# EAGLE design mssaPIC12smd (EAGLE 9.6.2)
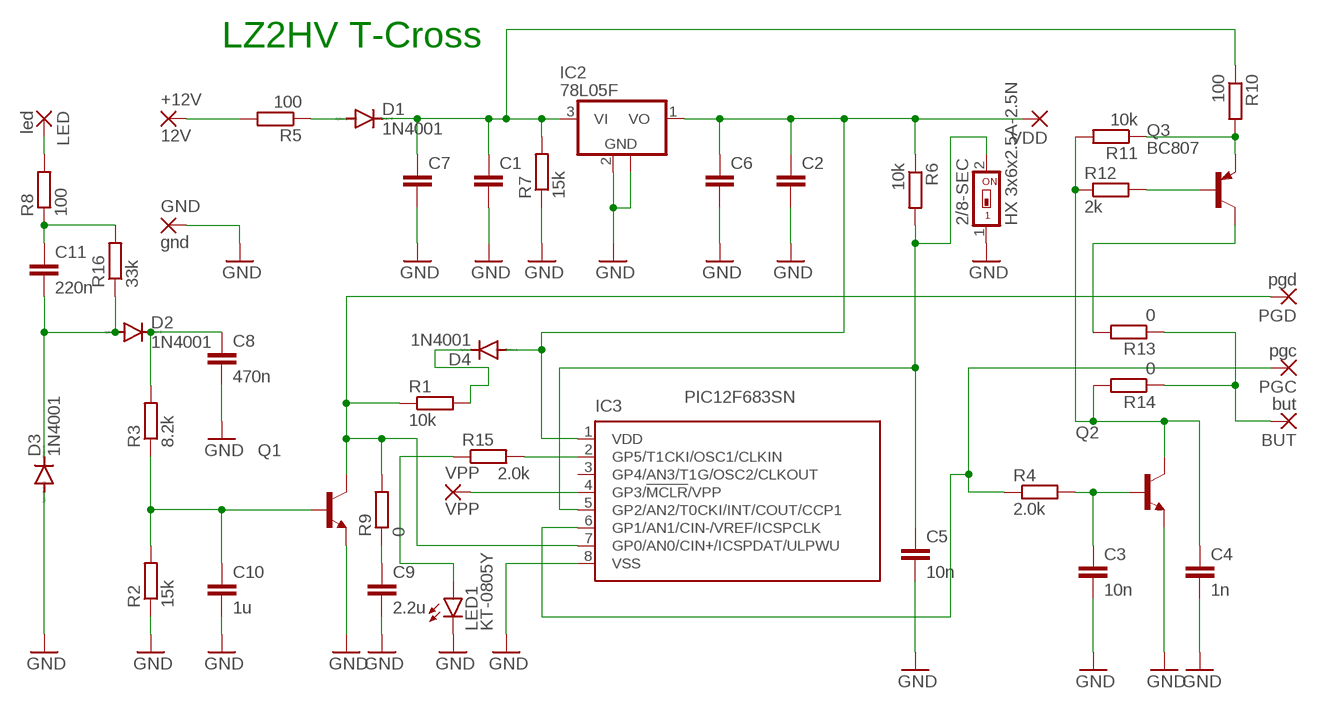
[diagram p0: schematic, sheet 1]

## Parts
2/8-SEC  HX 3x6x2.5A-2.5N  SWS001  [SMS-001]
+12V  12V  3,17/1,3  [3,17/1,3]
BUT  but  3,17/1,3  [3,17/1,3]
C1  100n  C-EUC1206K  [C1206K]
C2  220n  C-EUC1206K  [C1206K]
C3  10n  C-EUC1206K  [C1206K]
C4  1n  C-EUC1206K  [C1206K]
C5  10n  C-EUC1206K  [C1206K]
C6  100n  C-EUC1206K  [C1206K]
C7  100n  C-EUC1206K  [C1206K]
C8  470n  C-EUC1206K  [C1206K]
C9  2.2u  C-EUC1206K  [C1206K]
C10  1u  C-EUC1206K  [C1206K]
C11  220n  C-EUC1206K  [C1206K]
D1  1N4001  CGRM4001-G  [SOD-123_MINI-SMA]
D2  1N4001  CGRM4001-G  [SOD-123_MINI-SMA]
D3  1N4001  CGRM4001-G  [SOD-123_MINI-SMA]
D4  1N4001  CGRM4001-G  [SOD-123_MINI-SMA]
GND  gnd  3,17/1,3  [3,17/1,3]
IC2  78L05F  [SOT89]
IC3  PIC12F683SN  [SO-08]
LED  led  3,17/1,3  [3,17/1,3]
LED1  KT-0805Y  LEDCHIP-LED0805  [CHIP-LED0805]
PGC  pgc  2,15/1,0  [2,15/1,0]
PGD  pgd  2,15/1,0  [2,15/1,0]
Q1  BC817  BC817-40LT1SMD  [SOT23-BEC]
Q2  BC817  BC817-40LT1SMD  [SOT23-BEC]
Q3  BC807  BC807-40SMD  [SOT23-BEC]
R1  10k  R-EU_M1206  [M1206]
R2  15k  R-EU_M1206  [M1206]
R3  8.2k  R-EU_M1206  [M1206]
R4  2.0k  R-EU_M1206  [M1206]
R5  100  R-EU_M1206  [M1206]
R6  10k  R-EU_M1206  [M1206]
R7  15k  R-EU_M1206  [M1206]
R8  100  R-EU_M1206  [M1206]
R9  0  R-EU_R0603  [R0603]
R10  100  R-EU_M1206  [M1206]
R11  10k  R-EU_M1206  [M1206]
R12  2k  R-EU_M1206  [M1206]
R13  0  R-EU_R0603  [R0603]
R14  0  R-EU_R0603  [R0603]
R15  2.0k  R-EU_R0603  [R0603]
R16  33k  R-EU_M1206  [M1206]
VDD  VDD  2,15/1,0  [2,15/1,0]
VPP  VPP  2,15/1,0  [2,15/1,0]

## Nets
GND: 2/8-SEC.1 C1.2 C2.2 C3.2 C4.2 C5.2 C6.2 C7.2 C8.2 C9.2 C10.2 D3.A GND.1(P) IC2.2(GND) IC2.2@1(GND) IC3.8(VSS) LED1.C Q1.E Q2.E R2.1 R7.1
N$1: C1.1 C7.1 D1.C IC2.3(VI) R7.2 R10.1
N$2: C11.2 D2.A D3.C R16.1
N$3: C10.1 Q1.B R2.2 R3.1
N$4: IC3.7(GP0/AN0/CIN+/ICSPDAT/ULPWU) PGD.1(P) Q1.C R1.1 R9.2
N$5: +12V.1(P) R5.2
N$6: IC3.6(GP1/AN1/CIN-/VREF/ICSPCLK) PGC.1(P) R4.1
N$7: C3.1 Q2.B R4.2
N$8: C4.1 Q2.C R11.2 R12.1 R14.2
N$9: C8.1 D2.C R3.2
N$10: D1.A R5.1
N$11: IC3.4(GP3/!MCLR!/VPP) VPP.1(P)
N$12: 2/8-SEC.2 C5.1 IC3.5(GP2/AN2/T0CKI/INT/COUT/CCP1) R6.2
N$13: C11.1 R8.1 R16.2
N$14: LED.1(P) R8.2
N$15: C9.1 R9.1
N$16: Q3.E R10.2 R11.1
N$17: Q3.C R13.2
N$18: Q3.B R12.2
N$19: BUT.1(P) R13.1 R14.1
N$20: IC3.2(GP5/T1CKI/OSC1/CLKIN) R15.2
N$21: LED1.A R15.1
N$22: D4.C R1.2
VDD: C2.1 C6.1 D4.A IC2.1(VO) IC3.1(VDD) R6.1 VDD.1(P)
Unconnected: IC3.3(GP4/AN3/T1G/OSC2/CLKOUT)

## Notes on the sheet
- LZ2HV T-Cross

## Library data of the parts
2/8-SEC = smd-special:SWS001: SMD Dip Switch 1 pol.
+12V BUT GND LED = wirepad:3,17/1,3: THROUGH-HOLE PAD
C1-C11 = rcl:C-EU: CAPACITOR, European symbol; SPICEPREFIX: C
D1-D4 = diode:CGRM400*-G: Molded plasitc,JEDEC SOD-123/Mini SMA Source: Comchip CGRM4001-G.pdf
IC2 = linear:78L*: POSITOIV-VOLTAGE REGULATORS Output up to 100 mA Source: Datasheet <http://focus.ti.com/lit/ds/symlink/ua78l05.pdf>
IC3 = microchip:PIC12F683: 8-Pin Flash-Based, 8-Bit CMOS Microcontrollers with nanoWatt Technology Source: http://ww1.microchip.com/downloads/en/DeviceDoc/41211D_.pdf; MF: MICROCHIP; MPN: PIC12F683-I/SN; OC_FARNELL: 9759042; OC_NEWARK: 61K3434
LED1 = led:LED: LED OSRAM: - CHIPLED LG R971, LG N971, LY N971, LG Q971, LY Q971, LO R971, LY R971 LH N974, LH R974 LS Q976, LO Q976, LY Q976 LO Q996 - Hyper CHIPLED LW Q18S LB Q993, LB Q99A, LB R99A - SideLED LS A670, LO A670, LY A670, LG A670, LP A670 LB A673, LV A673, LT A673, LW A673 LH A674 LY A675 LS A676, LA A676, LO A676, LY A676, LW A676 LS A679, LY A679, LG A679 - Hyper Micro SIDELED® LS Y876, LA Y876, LO Y876, LY Y876 LT Y87S - SmartLED LW L88C, LW L88S LB L89C, LB L89S, LG L890 LS L89K, LO L89K, LY L89K LS L896, LA L896, LO L896, LY L896 - TOPLED LS T670, LO T670, LY T670, LG T670, LP T670 LSG T670, LSP T670, LSY T670, LOP T670, LYG T670 LG T671, LOG T671, LSG T671 LB T673, LV T673, LT T673, LW T673 LH T674 LS T676, LA T676, LO T676, LY T676, LB T676, LH T676, LSB T676, LW T676 LB T67C, LV T67C, LT T67C, LS T67K, LO T67K, LY T67K, LW E67C LS E67B, LA E67B, LO E67B, LY E67B, LB E67C, LV E67C, LT E67C LW T67C LS T679, LY T679, LG T679 LS T770, LO T770, LY T770, LG T770, LP T770 LB T773, LV T773, LT T773, LW T773 LH T774 LS E675, LA E675, LY E675, LS T675 LS T776, LA T776, LO T776, LY T776, LB T776 LHGB T686 LT T68C, LB T68C - Hyper Mini TOPLED® LB M676 - Mini TOPLED Santana® LG M470 LS M47K, LO M47K, LY M47K Source: http://www.osram.convergy.de LUXEON: - LUMILED® LXK2-PW12-R00, LXK2-PW12-S00, LXK2-PW14-U00, LXK2-PW14-V00 LXK2-PM12-R00, LXK2-PM12-S00, LXK2-PM14-U00 LXK2-PE12-Q00, LXK2-PE12-R00, LXK2-PE12-S00, LXK2-PE14-T00, LXK2-PE14-U00 LXK2-PB12-K00, LXK2-PB12-L00, LXK2-PB12-M00, LXK2-PB14-N00, LXK2-PB14-P00, LXK2-PB14-Q00 LXK2-PR12-L00, LXK2-PR12-M00, LXK2-PR14-Q00, LXK2-PR14-R00 LXK2-PD12-Q00, LXK2-PD12-R00, LXK2-PD12-S00 LXK2-PH12-R00, LXK2-PH12-S00 LXK2-PL12-P00, LXK2-PL12-Q00, LXK2-PL12-R00 Source: www.luxeon.com KINGBRIGHT: KA-3528ASYC Source: www.kingbright.com
PGC PGD VDD VPP = wirepad:2,15/1,0: THROUGH-HOLE PAD
Q1 Q2 = transistor-npn:BC817*: NPN Transistor
Q3 = transistor-pnp:BC807*: PNP Transistror
R1-R16 = rcl:R-EU_: RESISTOR, European symbol; SPICEPREFIX: R

## Board
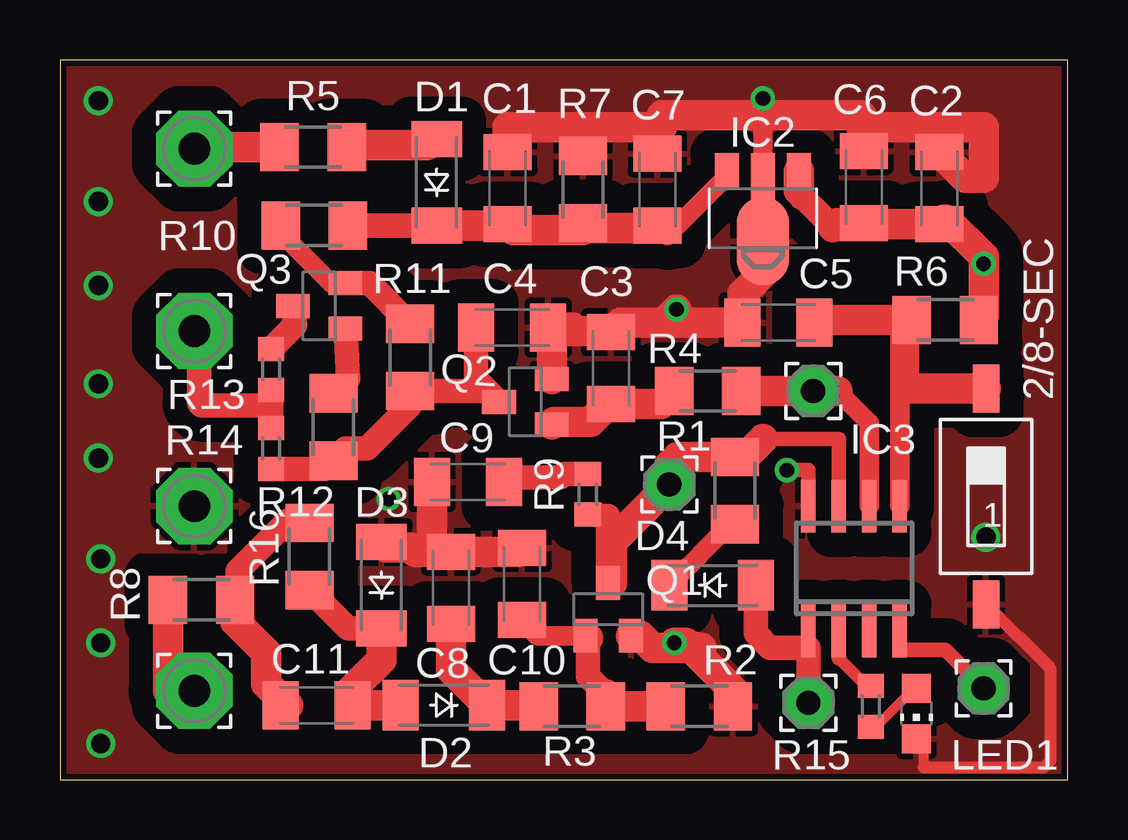
[diagram p1: board, top side]
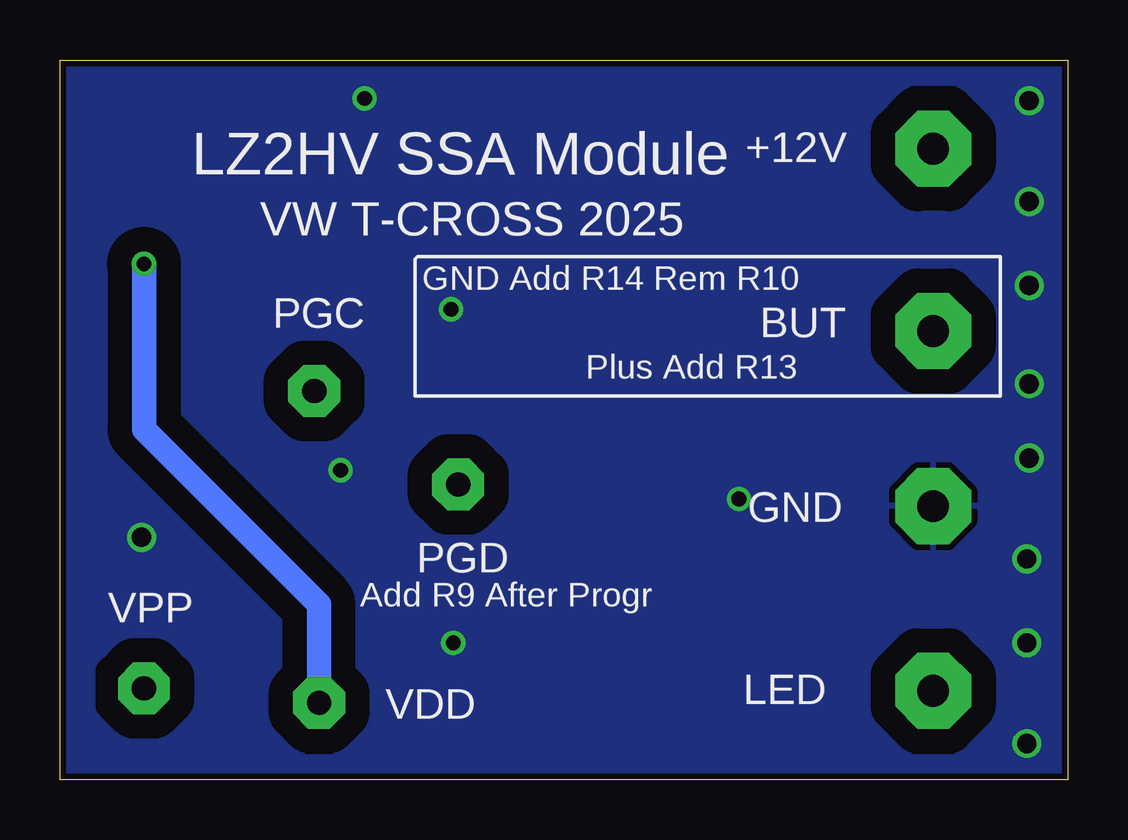
[diagram p2: board, bottom side, seen from below]

Size 42 x 30 mm. Coordinates in mm from the lower left corner, seen from the top.
Outline: 0,0 42,0 42,30 0,30 0,0
Copper layers (1*16): Top 0.035mm / dielectric 1.5mm / Bottom 0.035mm
Design rules "default *": minimum track width 10mil, minimum drill 24mil, track to track 8mil, track to pad 8mil, pad to pad 8mil, via to via 8mil, smd to smd 8mil, copper to edge 10mil, drill to drill 6mil, minimum pad ring 10mil, minimum via ring 8mil, stop-mask expansion 4mil, vias tented up to drill 0mil, thermal gap 10mil

### Footprints (pad centres in the part's own frame; a part is rotated, then mirrored left to right if it is on the bottom)
SMS-001 = smd 1.092 x 2.007: 1 0,-4.496; 2 0,4.496
3,17/1,3 = drill 1.321 pad 3.175 octagon: 1 0,0
C1206K = smd 1.5 x 2: 1 -1.5,0; 2 1.5,0
SOD-123_MINI-SMA = smd 1.5 x 2.1: A 1.8,0; C -1.8,0
SOT89 = smd 1 x 1.5: 1 -1.499,-1.981; 3 1.499,-1.981 | smd 1 x 2: 2 0,-1.727 | smd 2.2 x 3.7: 2@1 0,0.94
SO-08 = smd 0.6 x 2.2: 1 -1.905,-2.6; 2 -0.635,-2.6; 3 0.635,-2.6; 4 1.905,-2.6; 5 1.905,2.6; 6 0.635,2.6; 7 -0.635,2.6; 8 -1.905,2.6
CHIP-LED0805 = smd 1.2 x 1.2: A 0,-1.05; C 0,1.05
2,15/1,0 = drill 1.016 pad 2.159 octagon: 1 0,0
SOT23-BEC = smd 1 x 1.4: B -0.95,-1.1; C 0,1.1; E 0.95,-1.1
M1206 = smd 1.6 x 2: 1 -1.4,0; 2 1.4,0
R0603 = smd 1 x 1.1: 1 -0.85,0; 2 0.85,0

### Placement (x,y rotation side)
2/8-SEC  38.6,11.8 0 top
+12V  5.6,26.3 0 top
BUT  5.6,18.7 0 top
C1  18.66,24.65 90 top
C2  36.66,24.65 90 top
C3  22.96,17.15 90 top
C4  18.85,18.84 0 top
C5  29.95,19.06 180 top
C6  33.5,24.7 90 top
C7  24.9,24.6 90 top
C8  16.3,8 90 top
C9  17,12.4 180 top
C10  19.26,8.15 90 top
C11  10.7,3.1 0 top
D1  15.7,24.9 90 top
D2  16,3.1 180 top
D3  13.4,8.1 90 top
D4  27.2,8.1 0 top
GND  5.6,11.4 0 top
IC2  29.3,23.38 180 top
IC3  33.1,8.8 0 top
LED  5.6,3.7 0 top
LED1  35.7,2.75 180 top
PGC  31.4,16.2 0 top
PGD  25.4,12.3 0 top
Q1  22.85,7.1 0 top
Q2  19.4,15.75 90 top
Q3  10.8,19.75 90 top
R1  28.14,12.05 270 top
R2  26.65,3.06 180 top
R3  21.35,3.06 180 top
R4  27,16.2 180 top
R5  10.55,26.36 180 top
R6  36.9,19.16 180 top
R7  21.8,24.6 270 top
R8  5.9,7.5 180 top
R9  22,11.9 270 top
R10  10.6,23.1 180 top
R11  14.6,17.6 270 top
R12  11.4,14.7 90 top
R13  8.8,17.1 90 top
R14  8.8,13.8 270 top
R15  33.8,3.05 90 top
R16  10.4,9.3 90 top
VDD  31.2,3.2 0 top
VPP  38.5,3.8 0 top

### Tracks (layer width: path | path; a pad name or v marks a point on that pad's centre or on a via)
GND  (via drill 0.61, 0.8)
  Top 0.406: LED1.C 35.99,1.41 35.99,0.51
  Top 0.508: 35.99,0.51 41.01,0.51 41.3,0.8 41.3,4.6 2/8-SEC.1
  Top 0.61: IC3.8 31.2,12.9 v30.3,12.9
  Top 0.813: 29.3,27.7 IC2.2 IC2.2@1 | C6.2 33.5,27.2 | 33.4,27.2 33.4,27.7
  Top 1.27: R2.1 28.05,3.75 26.1,5.7 v25.6,5.7 26.73,5.5 24.7,5.5 24.2,6 Q1.E | C2.2 37.71,25.1 38.5,25.1 38.5,27.2 33.5,27.2 33.4,27.2 | 33.4,27.7 29.3,27.7 25.1,27.7 25.1,27.2 24.9,27.2 | 25.16,19.06 23.37,19.06 C3.2 22.91,18.7 21.5,18.7 | 25.16,19.06 C5.2 28.45,20.25 29.7,21.5 29.7,22.04 IC2.2@1 | C1.2 18.66,27.2 21.8,27.2 | 21.8,27.2 24.9,27.2 | v25.7,19.6 25.16,19.06 | C7.2 24.9,27.2 | R7.1 21.8,27.2 | D3.A 13.62,9.68 14.62,9.68 14.8,9.5 16,9.5 | 16,9.5 C8.2 19.11,9.5 C10.2 | C9.2 15.5,10 16,9.5 | Q2.E 20.5,18.6 20.6,18.7 21.5,18.7 | C4.2 21.36,18.84 21.5,18.7
  other vias: 1.6,28.3 1.6,24.1 1.6,20.6 1.6,16.5 1.6,13.4 1.7,9.2 1.7,5.7 1.7,1.5 29.3,28.4 38.6,10.1 13.7,11.7
  pour Bottom (isolate 1.016): 0,30 42,30 42,0 0,0
  pour Top (isolate 1.016): 0,30 42,30 42,0 0,0
  pour Top: 1.2,30 1.2,13.4 6.9,13.4 6.9,9.5 1.1,9.5 1.1,1 40.5,1 40.5,29 1.3,29 1.3,30 42.1,30 42.1,0 0,0 0,30
  pour Bottom: 1.1,30 1.1,13.4 6.9,13.4 6.9,9.5 1,9.5 1,1 40.6,1 40.6,29 1.2,29 1.2,30 42,30 42,0 0,0 0,30
N$1
  Top 0.61: 18.91,22.9 C1.1 | 25.32,22.68 C7.1
  Top 0.813: IC2.3 27.8,25.16 25.32,22.68
  Top 1.016: R10.1 D1.C
  Top 1.27: C7.1 24.8,23 22,23 R7.2 21.8,22.9 18.91,22.9 | C1.1 18.61,23.1 D1.C
N$2
  Top 1.016: R16.1 12,6.3 D3.C
  Top 1.27: D3.C 13.4,5 12.2,3.8 C11.2 D2.A
N$3
  Top 0.813: Q1.B 19.91,6 C10.1
  Top 1.016: 22,5.9 22,4.31 22.75,3.56
  Top 1.27: R2.2 R3.1 22.75,3.56 | Q1.B 22,5.9
N$4
  Top 0.61: IC3.7 32.47,14.2 29.3,14.2
  Top 1.016: R9.2 22.85,10.98 Q1.C 23,8.2
  Top 1.27: 23,8.2 23,9.9 PGD.1 25.39,12.31 25.39,13.1 25.74,13.45 R1.1 28.55,13.45 29.3,14.2
N$5
  Top 1.27: +12V.1 5.61,26.36 R5.2
N$6
  Top 0.813: IC3.6 33.73,14.87 32.4,16.2
  Top 1.27: 32.4,16.2 PGC.1 R4.1
N$7
  Top 1.27: Q2.B 20.6,14.9 22.11,14.9 22.86,15.65 C3.1 25.06,15.65 25.6,16.19 R4.2
N$8
  Top 1.016: C4.1 17.35,16.7 Q2.C 17.85,16.2 R11.2 14.6,15.6 12.8,13.8 11.9,13.8 R12.1 11.05,12.95 R14.2
N$9
  Top 1.27: R3.2 19.91,3.1 D2.C 16.3,4.6 C8.1
N$10
  Top 1.27: R5.1 12.03,26.44 15.3,26.44 D1.A
N$11
  Top 0.61: IC3.4 35,5.4 36.9,5.4 VPP.1
N$12
  Top 0.813: R6.2 35.4,19.06 35.4,18.8 35.4,16.3 | 35,19.2 IC3.5
  Top 1.27: C5.1 31.55,19.16 R6.2 | 2/8-SEC.2 35.4,16.3 | 35.4,18.8 35,19.2
N$13
  Top 1.016: R8.1 7.4,7.6 7.4,8.7 9.5,10.8 10.3,10.8 R16.2
  Top 1.27: R8.1 7.3,6.6 8.6,5.3 8.6,4 9.5,3.1 C11.1
N$14
  Top 1.27: R8.2 4.5,3.72 4.51,3.7 LED.1
N$15
  Top 1.016: C9.1 18.7,12.6 20.85,12.6 21,12.75 R9.1
N$16
  Top 0.813: Q3.E 11.3,20.7 9.2,22.8 R10.2
  Top 1.016: Q3.E 12.9,20.7 R11.1
N$17
  Top 1.016: R13.2 9.8,18.95 Q3.C
N$18
  Top 1.016: R12.2 12,16.7 Q3.B
N$19
  Top 1.016: R14.1 8.8,15.6 | 8.8,15.6 R13.1 | BUT.1 5.8,18.5 5.8,15.7 5.9,15.6 8.8,15.6
N$20
  Top 0.406: R15.2 33.62,3.9
  Top 0.508: 33.62,3.9 32.47,5.05
  Top 0.61: 32.47,5.05 IC3.2
N$21
  Top 0.406: LED1.A 35.5,3.8 35.3,3.6 35.3,3.5 34,2.2 R15.1
N$22
  Top 0.813: D4.C 27.95,10.65 R1.2
VDD  (via drill 0.61)
  Top 0.61: 30.8,24.56 30.8,24.36 30.9,24.26 | IC3.1 31.2,5.5
  Top 1.016: 30.9,24.26 31,24.26 32.22,23.04 | VDD.1 31.2,5.5 29.6,5.5 29,6.1 D4.A
  Top 1.27: IC2.1 30.8,24.56 | 32.22,23.04 32.38,23.2 C6.1 33.55,23.15 C2.1 36.85,23.34 36.96,23.34 38.5,21.8 v38.5,21.5 38.5,19.36 R6.1
  Bottom 1.016: v38.5,21.5 38.5,14.6 31.2,7.3 VDD.1

### Text on the board
bNames: LZ2HV SSA Module | VW T-CROSS 2025 | GND Add R14 Rem R10 | Plus Add R13 | Add R9 After Progr